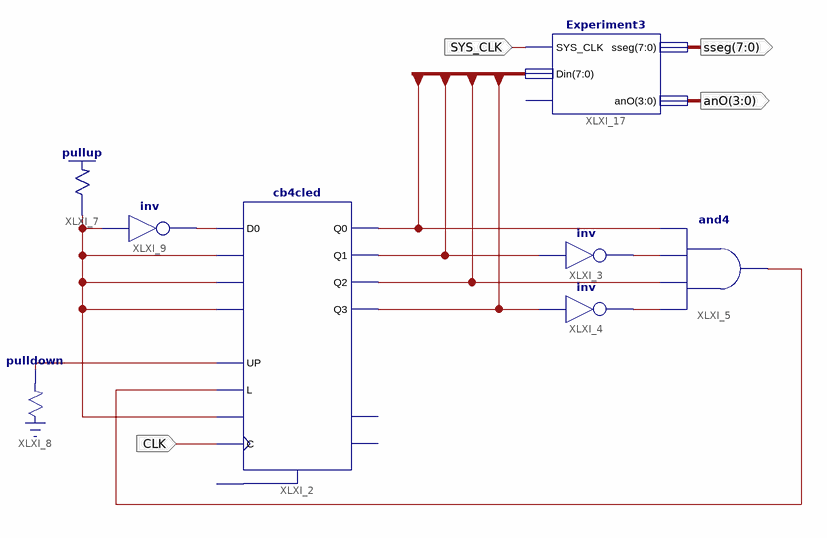
[diagram p0: schematic sheet 1]
// Xilinx ISE schematic Experiment6.sch (spartan3e) as structural Verilog: 8 symbols, 4 ports
module Experiment6 (
  input  CLK,
  input  SYS_CLK,
  output [7:0] sseg,
  output [3:0] anO
);

  wire XLXN_27, XLXN_28, XLXN_30, XLXN_37, XLXN_38, XLXN_39;
  wire [7:0] Din;

  cb4cled XLXI_2 (
    .C(CLK), .CE(XLXN_30), .D0(XLXN_37), .D1(XLXN_30), .D2(XLXN_30), .D3(XLXN_30), .L(XLXN_38), .UP(XLXN_39),
    .Q0(Din[0]), .Q1(Din[1]), .Q2(Din[2]), .Q3(Din[3]));  // open: CLR, CEO, TC
  not XLXI_3 (XLXN_27, Din[1]);
  not XLXI_4 (XLXN_28, Din[3]);
  and XLXI_5 (XLXN_38, XLXN_28, Din[2], XLXN_27, Din[0]);
  not XLXI_9 (XLXN_37, XLXN_30);
  \pullup  XLXI_7 (.O(XLXN_30));
  \pulldown  XLXI_8 (.O(XLXN_39));
  Experiment3 XLXI_17 (.SYS_CLK(SYS_CLK), .Din(Din), .sseg(sseg), .anO(anO));  // open: En
endmodule
